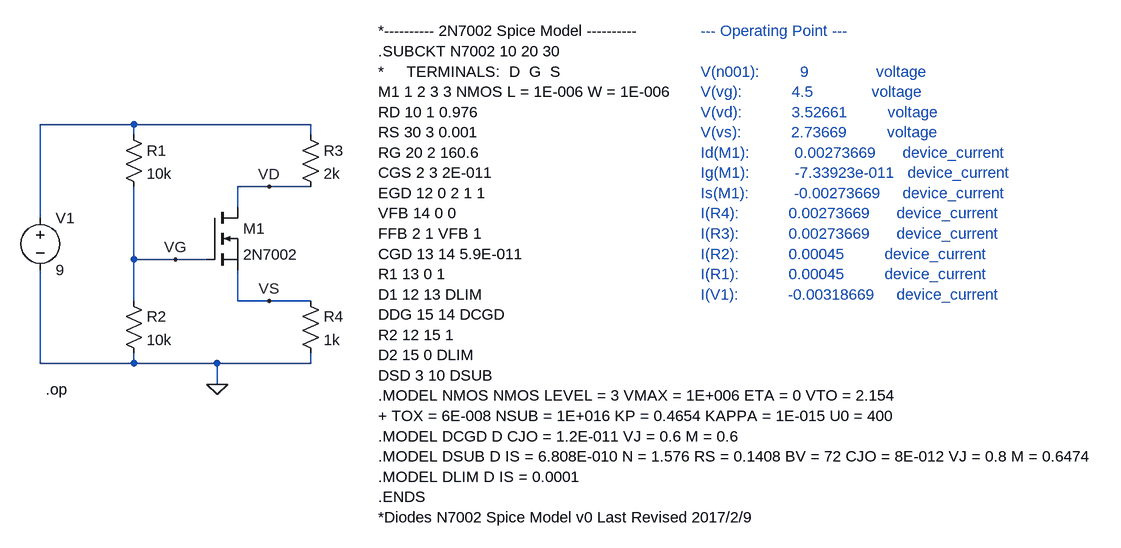
[diagram p0: schematic Draft2.asc]
Draft2.asc, the LTspice schematic file:
Version 4
SHEET 1 1776 680
WIRE 224 -32 80 -32
WIRE 496 -32 224 -32
WIRE 224 -16 224 -32
WIRE 496 -16 496 -32
WIRE 432 64 384 64
WIRE 496 64 432 64
WIRE 384 96 384 64
WIRE 80 112 80 -32
WIRE 224 176 224 64
WIRE 288 176 224 176
WIRE 336 176 288 176
WIRE 224 240 224 176
WIRE 384 240 384 192
WIRE 432 240 384 240
WIRE 496 240 432 240
WIRE 80 336 80 192
WIRE 224 336 224 320
WIRE 224 336 80 336
WIRE 352 336 224 336
WIRE 496 336 496 320
WIRE 496 336 352 336
WIRE 352 368 352 336
FLAG 352 368 0
FLAG 288 176 VG
FLAG 432 64 VD
FLAG 432 240 VS
SYMBOL voltage 80 96 R0
WINDOW 123 0 0 Left 0
WINDOW 39 0 0 Left 0
SYMATTR InstName V1
SYMATTR Value 9
SYMBOL res 208 -32 R0
SYMATTR InstName R1
SYMATTR Value 10k
SYMBOL res 208 224 R0
SYMATTR InstName R2
SYMATTR Value 10k
SYMBOL res 480 -32 R0
SYMATTR InstName R3
SYMATTR Value 2k
SYMBOL res 480 224 R0
SYMATTR InstName R4
SYMATTR Value 1k
SYMBOL nmos 336 96 R0
SYMATTR InstName M1
SYMATTR Value 2N7002
TEXT 88 376 Left 2 !.op
TEXT 600 -176 Left 2 !*---------- 2N7002 Spice Model ----------\n.SUBCKT N7002 10 20 30 \n*     TERMINALS:  D  G  S\nM1 1 2 3 3 NMOS L = 1E-006 W = 1E-006 \nRD 10 1 0.976 \nRS 30 3 0.001 \nRG 20 2 160.6 \nCGS 2 3 2E-011 \nEGD 12 0 2 1 1 \nVFB 14 0 0 \nFFB 2 1 VFB 1 \nCGD 13 14 5.9E-011 \nR1 13 0 1 \nD1 12 13 DLIM \nDDG 15 14 DCGD \nR2 12 15 1 \nD2 15 0 DLIM \nDSD 3 10 DSUB \n.MODEL NMOS NMOS LEVEL = 3 VMAX = 1E+006 ETA = 0 VTO = 2.154 \n+ TOX = 6E-008 NSUB = 1E+016 KP = 0.4654 KAPPA = 1E-015 U0 = 400 \n.MODEL DCGD D CJO = 1.2E-011 VJ = 0.6 M = 0.6 \n.MODEL DSUB D IS = 6.808E-010 N = 1.576 RS = 0.1408 BV = 72 CJO = 8E-012 VJ = 0.8 M = 0.6474 \n.MODEL DLIM D IS = 0.0001 \n.ENDS\n*Diodes N7002 Spice Model v0 Last Revised 2017/2/9
TEXT 1096 -176 Left 2 ;--- Operating Point ---\n \nV(n001):         9               voltage\nV(vg):           4.5             voltage\nV(vd):           3.52661         voltage\nV(vs):           2.73669         voltage\nId(M1):          0.00273669      device_current\nIg(M1):          -7.33923e-011   device_current\nIs(M1):          -0.00273669     device_current\nI(R4):           0.00273669      device_current\nI(R3):           0.00273669      device_current\nI(R2):           0.00045         device_current\nI(R1):           0.00045         device_current\nI(V1):           -0.00318669     device_current

The netlist it stands for:
* Draft2.asc
V1 N001 0 9
R1 N001 VG 10k
R2 VG 0 10k
R3 N001 VD 2k
R4 VS 0 1k
M1 VD VG VS VS 2N7002
.model NMOS NMOS
.model PMOS PMOS
.lib standard.mos
.op
*---------- 2N7002 Spice Model ----------
.SUBCKT N7002 10 20 30
*     TERMINALS:  D  G  S
M1 1 2 3 3 NMOS L = 1E-006 W = 1E-006
RD 10 1 0.976
RS 30 3 0.001
RG 20 2 160.6
CGS 2 3 2E-011
EGD 12 0 2 1 1
VFB 14 0 0
FFB 2 1 VFB 1
CGD 13 14 5.9E-011
R1 13 0 1
D1 12 13 DLIM
DDG 15 14 DCGD
R2 12 15 1
D2 15 0 DLIM
DSD 3 10 DSUB
.MODEL NMOS NMOS LEVEL = 3 VMAX = 1E+006 ETA = 0 VTO = 2.154
+ TOX = 6E-008 NSUB = 1E+016 KP = 0.4654 KAPPA = 1E-015 U0 = 400
.MODEL DCGD D CJO = 1.2E-011 VJ = 0.6 M = 0.6
.MODEL DSUB D IS = 6.808E-010 N = 1.576 RS = 0.1408 BV = 72 CJO = 8E-012 VJ = 0.8 M = 0.6474
.MODEL DLIM D IS = 0.0001
.ENDS
*Diodes N7002 Spice Model v0 Last Revised 2017/2/9
* --- Operating Point ---
* V(n001):         9               voltage
* V(vg):           4.5             voltage
* V(vd):           3.52661         voltage
* V(vs):           2.73669         voltage
* Id(M1):          0.00273669      device_current
* Ig(M1):          -7.33923e-011   device_current
* Is(M1):          -0.00273669     device_current
* I(R4):           0.00273669      device_current
* I(R3):           0.00273669      device_current
* I(R2):           0.00045         device_current
* I(R1):           0.00045         device_current
* I(V1):           -0.00318669     device_current
.backanno
.end